# Altium schematic sheet ST_LINK.SchDoc
size A3; SheetNumber: 3; SheetTotal: 4
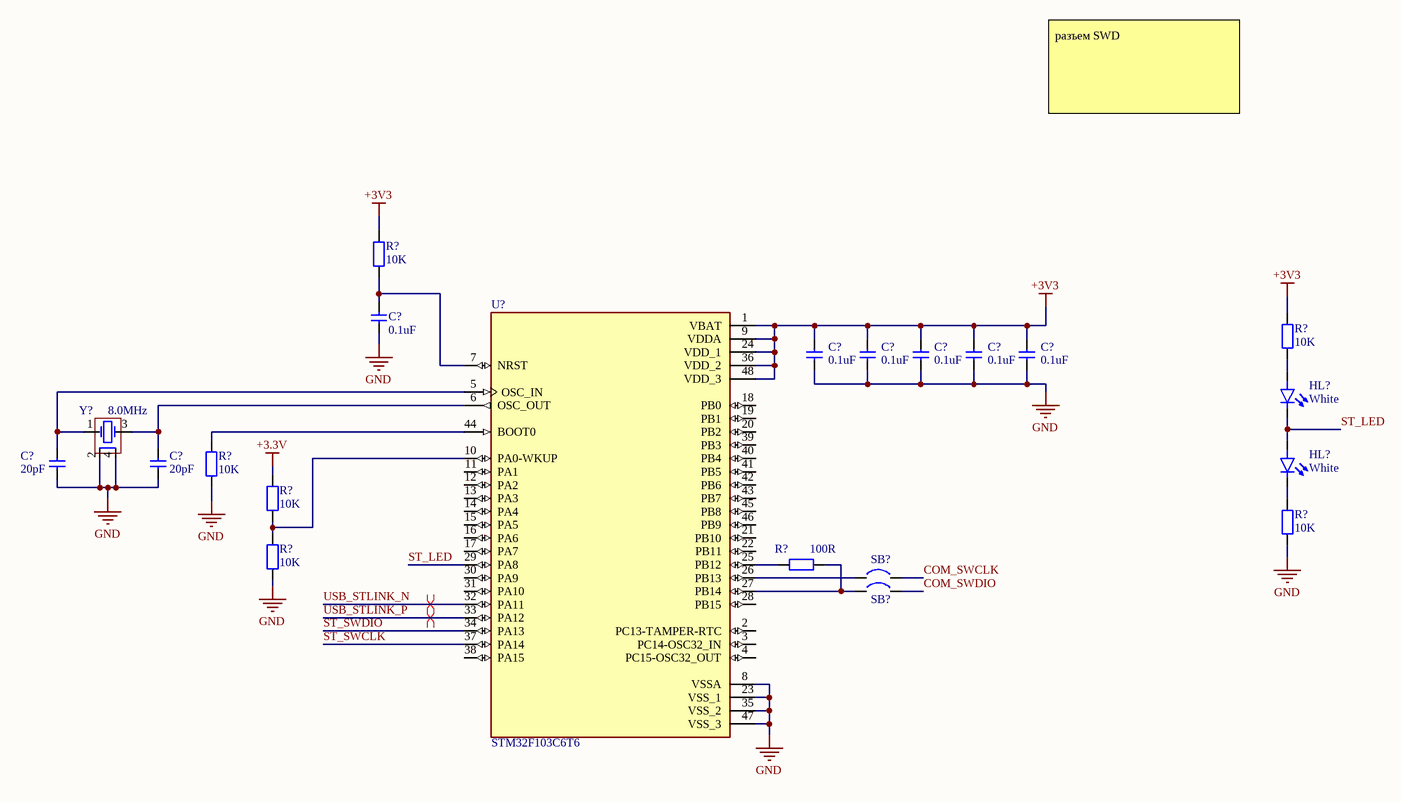
[diagram p0: ST_LINK.SchDoc]

## Parts
(Parts that share a designator on the sheet are numbered #1, #2 ... from top to bottom, then left to right.)
C?#1  0.1uF  [CAP0603]
C?#2  0.1uF  [CAP0603]
C?#3  0.1uF  [CAP0603]
C?#4  0.1uF  [CAP0603]
C?#5  0.1uF  [CAP0603]
C?#6  0.1uF  [CAP0603]
C?#7  20pF  [CAP0603]
C?#8  20pF  [CAP0603]
HL?#1  White  [LED0603_WHITE]
HL?#2  White  [LED0603_WHITE]
R?#1  10K  [RES0603]
R?#2  10K  [RES0603]
R?#3  10K  [RES0603]
R?#4  10K  [RES0603]
R?#5  10K  [RES0603]
R?#6  10K  [RES0603]
R?#7  100R  [RES0603]
SB?#1  Solder Bridge  [Solder Bridge]  (value not drawn)
SB?#2  Solder Bridge  [Solder Bridge]  (value not drawn)
U?  STM32F103C6T6  [LQFP48]
Y?  8.0MHz  [TSX-3225]

## Nets
+3.3V: R?#4.2
+3V3: C?#2.2 C?#3.2 C?#4.2 C?#5.2 C?#6.2 R?#1.2 R?#2.2 U?.1(VBAT) U?.9(VDDA) U?.24(VDD_1) U?.36(VDD_2) U?.48(VDD_3)
GND: C?#1.1 C?#2.1 C?#3.1 C?#4.1 C?#5.1 C?#6.1 C?#7.1 C?#8.1 R?#3.1 R?#5.1 R?#6.1 U?.8(VSSA) U?.23(VSS_1) U?.35(VSS_2) U?.47(VSS_3) Y?.2 Y?.4
COM_SWCLK: SB?#1.2
COM_SWDIO: SB?#2.2
ST_LED: HL?#1.1(K) HL?#2.2(A) U?.29(PA8)
ST_SWCLK: U?.37(PA14)
ST_SWDIO: U?.34(PA13)
USB_STLINK_N: U?.32(PA11)
USB_STLINK_P: U?.33(PA12)
NetC?#1_2: C?#1.2 R?#1.1 U?.7(NRST)
NetC?#7_2: C?#7.2 U?.5(OSC_IN) Y?.1
NetC?#8_2: C?#8.2 U?.6(OSC_OUT) Y?.3
NetHL?#1_2: HL?#1.2(A) R?#2.1
NetHL?#2_1: HL?#2.1(K) R?#5.2
NetR?#3_2: R?#3.2 U?.44(BOOT0)
NetR?#4_1: R?#4.1 R?#6.2 U?.10(PA0-WKUP)
NetR?#7_1: R?#7.1 U?.25(PB12)
NetR?#7_2: R?#7.2 SB?#2.1 U?.27(PB14)
NetSB?#1_1: SB?#1.1 U?.26(PB13)

Not connected (* = marked no-connect by the designer): U? 2(PC13-TAMPER-RTC) 3(PC14-OSC32_IN) 4(PC15-OSC32_OUT) 11(PA1) 12(PA2) 13(PA3) 14(PA4) 15(PA5) 16(PA6) 17(PA7) 18(PB0) 19(PB1) 20(PB2) 21(PB10) 22(PB11) 28(PB15) 30(PA9) 31(PA10) 38(PA15) 39(PB3) 40(PB4) 41(PB5) 42(PB6) 43(PB7) 45(PB8) 46(PB9)

## Layout directives
differential pair: USB_STLINK_N, USB_STLINK_P

## Notes on the sheet
- разъем SWD

## Library data of the parts
C?#1-C?#8 = CAP Ceramic: Ceramic SMD Cap
HL?#1 HL?#2 = LED: LED smd
R?#1-R?#7 = RES: RES smd
Y? = Quartz